# EAGLE design PillEndo-MkI_BATT2 (EAGLE 6.5.0)
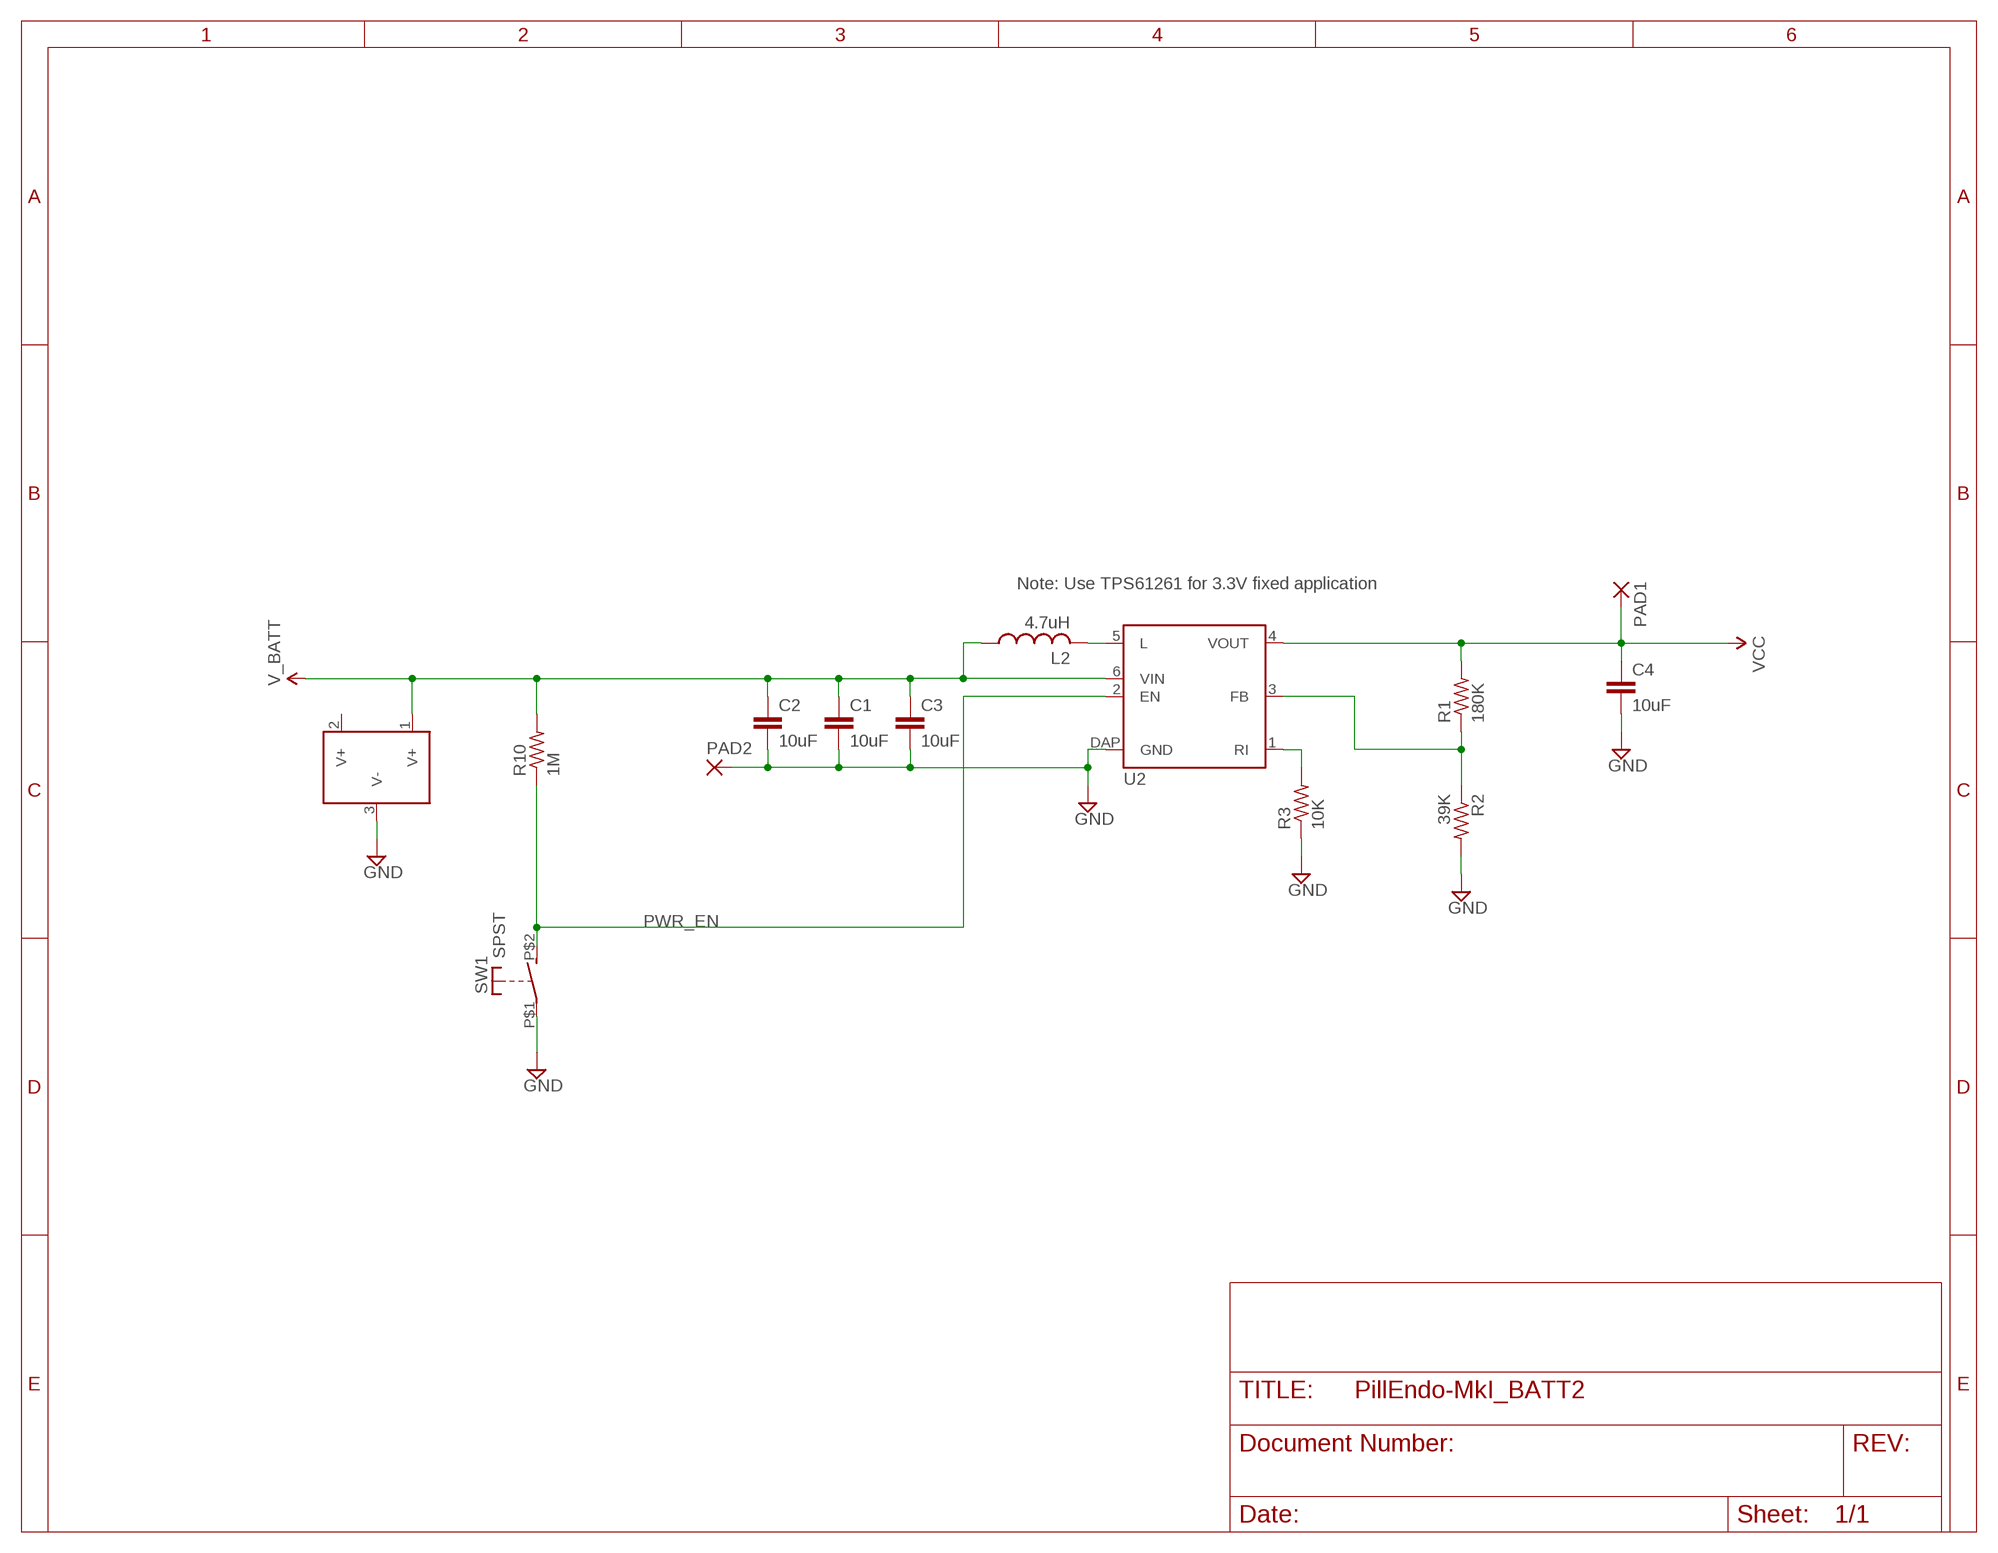
[diagram p0: schematic, sheet 1]

## Parts
C1  10uF  C0603  [C0603]
C2  10uF  C0603  [C0603]
C3  10uF  C0603  [C0603]
C4  10uF  C0603  [C0603]
J1  BATT_7.9MM_TH  [BATT_CLIP_7.9MM_TH]
L2  4.7uH  L0603  [L0603]
PAD1  SMD2  [SMD1,27-2,54]
PAD2  SMD2  [SMD1,27-2,54]
R1  180K  R0402  [R0402]
R2  39K  R0402  [R0402]
R3  10K  R0402  [R0402]
R10  1M  R0402  [R0402]
SW1  SPST  [CT05]
U2  TPS61260  [S-PWSON-N6]

## Nets
GND: C1.2 C2.2 C3.2 C4.2 J1.3(V-) PAD2.1(P) R2.2 R3.1 SW1.P$1(P) U2.DAP(GND)
N$2: L2.2 U2.5(L)
N$3: R1.1 R2.1 U2.3(FB)
N$4: R3.2 U2.1(RI)
PWR_EN: R10.1 SW1.P$2(S) U2.2(EN)
V_BATT: C1.1 C2.1 C3.1 J1.1(V+) L2.1 R10.2 U2.6(VIN)
VCC: C4.1 PAD1.1(P) R1.2 U2.4(VOUT)
Unconnected: J1.2(V+)

## Notes on the sheet
- Note: Use TPS61261 for 3.3V fixed application

## Library data of the parts
C1-C4 = MSSRP-Lib:C0603
J1 = MSSRP-Lib:BATT_7.9MM
L2 = MSSRP-Lib:L0603
PAD1 PAD2 = wirepad:SMD2: SMD PAD
R1-R3 R10 = MSSRP-Lib:R0402
SW1 = MSSRP-Lib:SPST
U2 = MSSRP-Lib:TPS61260

## Board
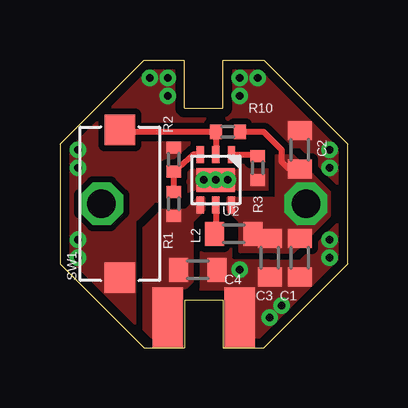
[diagram p1: board, top side]
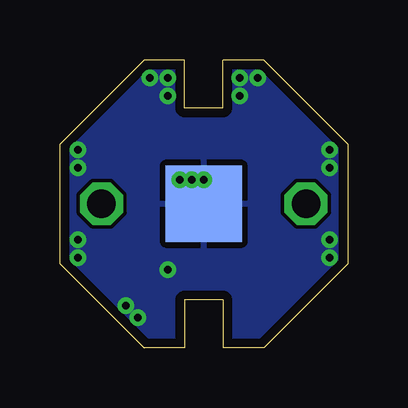
[diagram p2: board, bottom side, seen from below]

Size 12 x 12 mm. Coordinates in mm from the lower left corner, seen from the top.
Outline: 3.5,0 5.2,0 5.2,2 6.8,2 6.8,0 8.5,0 12,3.5 12,8.5 8.5,12 6.8,12 6.8,10 5.2,10 5.2,12 3.5,12 0,8.5 0,3.5 3.5,0
Copper layers (1*16): Top 0.0356mm / dielectric 1.5011mm / Bottom 0.0356mm
Design rules "LaenPCBOrder": minimum track width 6mil, minimum drill 13mil, track to track 6mil, track to pad 6mil, pad to pad 6mil, via to via 6mil, smd to smd 6mil, copper to edge 15mil, drill to drill 6mil, minimum pad ring 7mil, minimum via ring 7mil, stop-mask expansion 3mil, vias tented up to drill 0mil, thermal gap 10mil

### Footprints (pad centres in the part's own frame; a part is rotated, then mirrored left to right if it is on the bottom)
C0603 = smd 0.8 x 1: 1 -0.8,0; 2 0.8,0
BATT_CLIP_7.9MM_TH = drill 1.19 octagon: 1 -4.265,0; 2 4.265,0 | smd 3.17 x 3.17: 3 0,0
L0603 = smd 0.8 x 1: 1 -0.8,0; 2 0.8,0
SMD1,27-2,54 = smd 1.27 x 2.54: 1 0,0
R0402 = smd 0.5 x 0.6: 1 -0.5,0; 2 0.5,0
CT05 = smd 1.27 x 1.27: P$1 -3.075,0; P$2 3.075,0
S-PWSON-N6 = smd 0.3 x 0.7: 1 -0.65,-1.05; 2 0,-1.05; 3 0.65,-1.05; 4 0.65,1.05; 5 0,1.05; 6 -0.65,1.05 | smd 1.6 x 1: DAP 0,0

### Placement (x,y rotation side)
C1  10,3.75 270 top
C2  10,8.25 90 top
C3  8.75,3.75 270 top
C4  5.75,3.25 0 top
J1  6,6 0 bottom
L2  7.25,4.75 180 top
PAD1  4.5,1.25 0 top
PAD2  7.5,1.25 0 top
R1  4.75,6 270 top
R2  4.75,7.85 90 top
R3  8.25,7.5 90 top
R10  7,9 0 top
SW1  2.5,6 90 top
U2  6.5,7 180 top

### Tracks (layer width: path | path; a pad name or v marks a point on that pad's centre or on a via)
GND  (via drill 0.33)
  other vias: 6,7 8.75,1.25 9.25,1.75 11.25,3.75 11.25,4.5 11.25,7.5 11.25,8.25 0.75,4.5 0.75,3.75 3.75,11.25 4.5,11.25 4.5,10.5 7.5,10.5 7.5,11.25 8.25,11.25 7,7 6.5,7 0.75,8.25 0.75,7.5 7.5,3.25
  pour Bottom (isolate 0.127): 0,0 12,0 12,12 0,12
  pour Top (isolate 0.256, rank 6, no thermals): 0,0 12,0 12,12 0,12
N$2
  Top 0.254: U2.5 6.5,5.05 L2.2
N$3
  Top 0.254: R1.1 R2.1 5.55,8.05 U2.3
N$4
  Top 0.254: U2.1 8.25,8.05 R3.2
PWR_EN
  Top 0.254: U2.2 R10.1 2.58,9 SW1.P$2
V_BATT
  Top 0.254: C2.1 9.55,7.45 9.25,7.75 9.25,8.25 8.5,9 R10.2
  pour Top (isolate 0.127, no thermals): 9,8 9,4 9.75,4 11.25,5.5 11.25,6.5 9.75,8
  pour Top (no thermals): 9,4 7.5,4 7.5,5.25 7,5.75 7,6.25 9,6.25
VCC
  pour Top (no thermals): 4.25,5.75 5.25,5.75 5.75,6.25 6,6.25 6,5.75 5.5,5.25 5.5,2.75 5.25,2.5 5,2.5 5,0.25 4,0.25 3.5,0.75 3.5,5